# EAGLE design MKL02_Programmer (EAGLE 9.5.2)
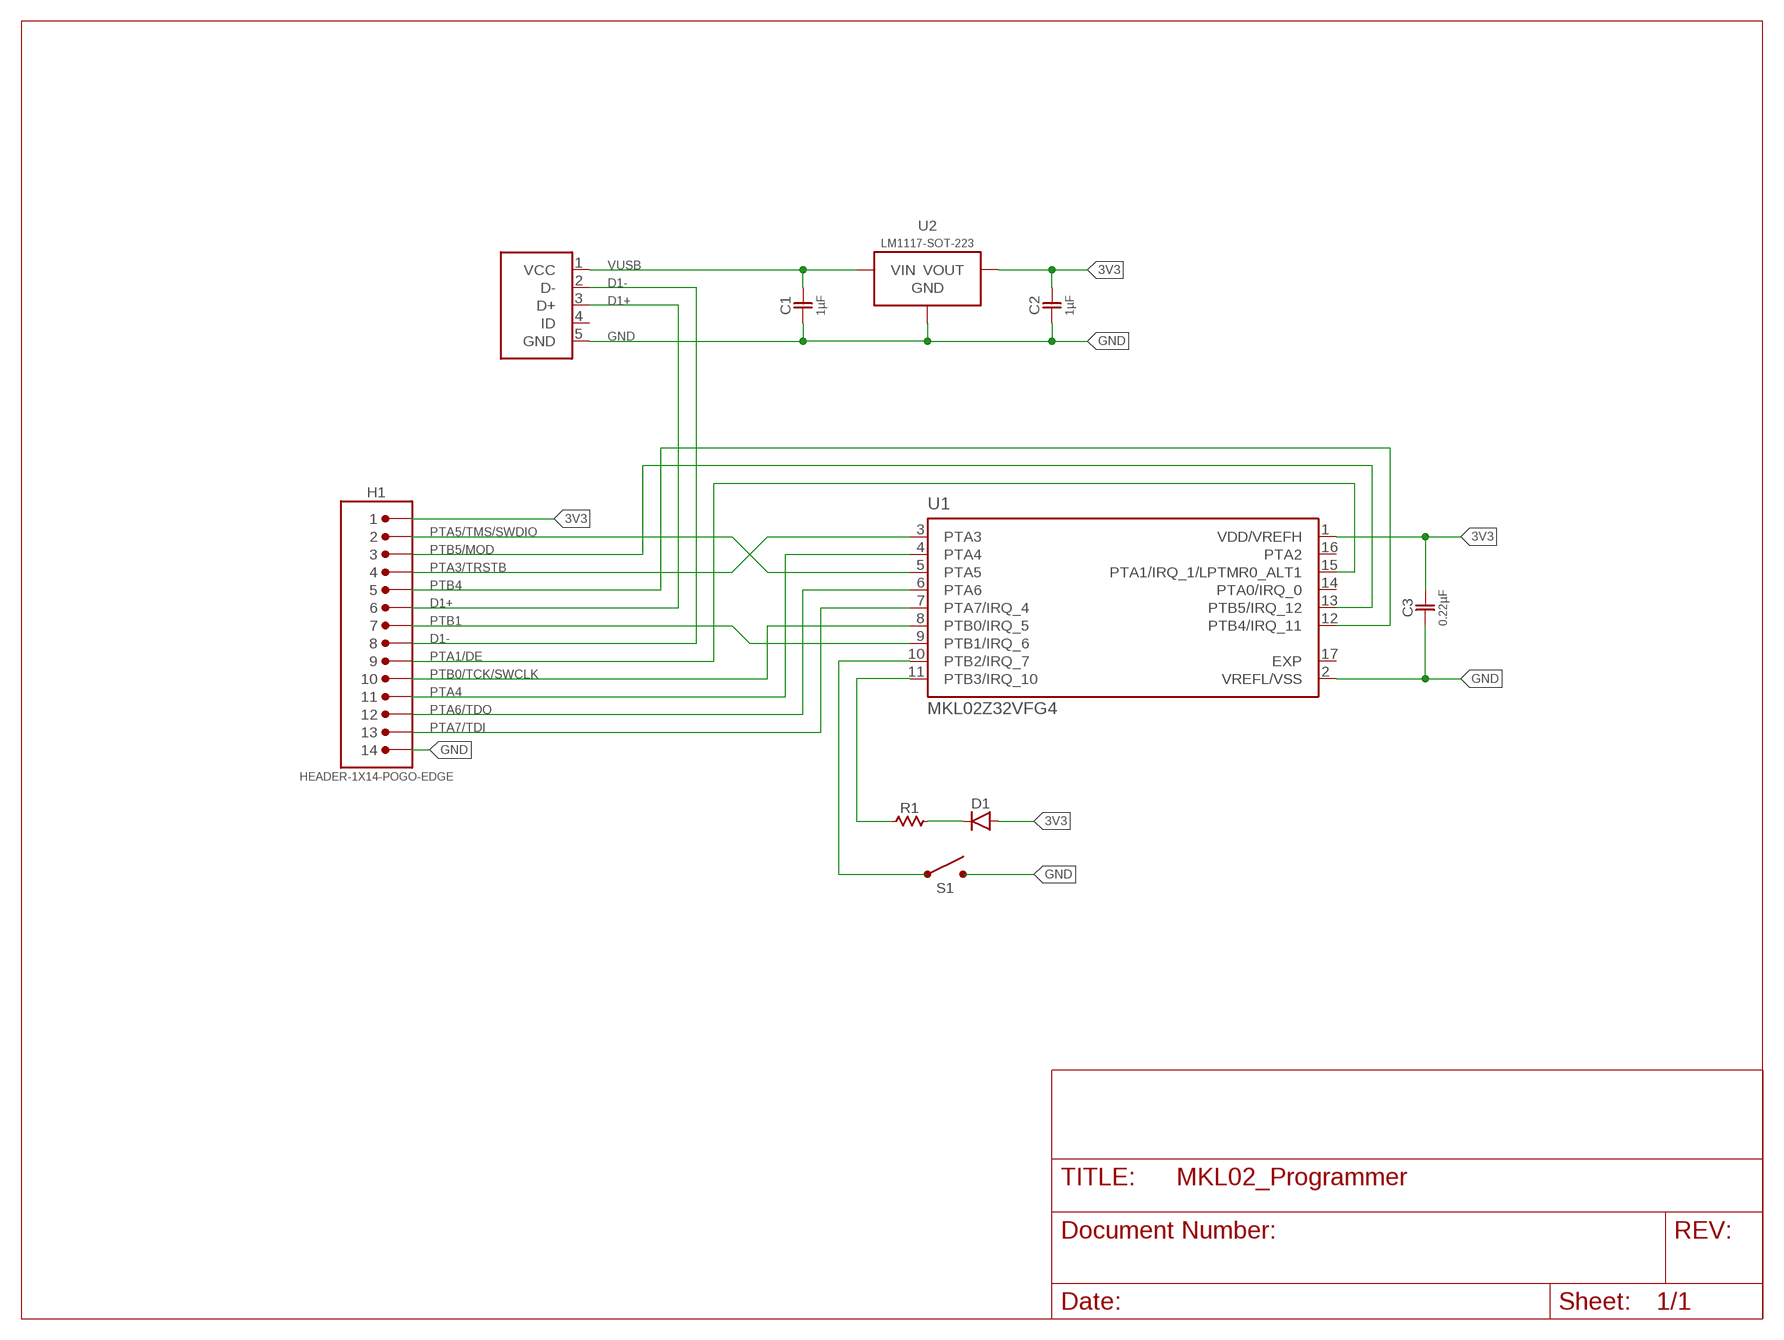
[diagram p0: schematic, sheet 1]

## Parts
C1  1µF  CAP-NP-0805  [0805-NP]
C2  1µF  CAP-NP-0805  [0805-NP]
C3  0.22µF  CAP-NP-0805  [0805-NP]
D1  DIODE-0805  [0805-P]
H1  HEADER-1X14-POGO-EDGE  [2X7-1.27MM-POGO-EDGE]
J1  USB-5-MICRO-B  [USB-MICRO-B]
R1  RESISTOR-0805  [0805-NP]
S1  SPST-6X6  [BUTTON-EVQQ2]
U1  MKL02Z32VFG4  [QFN50P300X300X65-17N]
U2  LM1117-SOT-223  [SOT-223]

## Nets
3V3: C2.2 C3.2 D1.A H1.1 U1.1(VDD/VREFH) U2.2(VOUT) U2.4(VOUT)
D1+: H1.6 J1.3(D+)
D1-: H1.8 J1.2(D-)
GND: C1.1 C2.1 C3.1 H1.14 J1.5(GND) S1.B1 S1.B2 U1.2(VREFL/VSS) U2.1(GND)
N$1: S1.A1 S1.A2 U1.10(PTB2/IRQ_7)
N$2: R1.1 U1.11(PTB3/IRQ_10)
N$3: D1.K(C) R1.2
PTA1/DE: H1.9 U1.15(PTA1/IRQ_1/LPTMR0_ALT1)
PTA3/TRSTB: H1.4 U1.3(PTA3)
PTA4: H1.11 U1.4(PTA4)
PTA5/TMS/SWDIO: H1.2 U1.5(PTA5)
PTA6/TDO: H1.12 U1.6(PTA6)
PTA7/TDI: H1.13 U1.7(PTA7/IRQ_4)
PTB0/TCK/SWCLK: H1.10 U1.8(PTB0/IRQ_5)
PTB1: H1.7 U1.9(PTB1/IRQ_6)
PTB4: H1.5 U1.12(PTB4/IRQ_11)
PTB5/MOD: H1.3 U1.13(PTB5/IRQ_12)
VUSB: C1.2 J1.1(VCC) U2.3(VIN)
Unconnected: J1.4(ID) U1.14(PTA0/IRQ_0) U1.16(PTA2)

## Power pins joined to a net without a drawn wire
EXP: U1.17(EXP)

## Library data of the parts
C1-C3 = T2M_4_0:CAP-NP
D1 = T2M_4_0:DIODE
H1 = T2M_4_0:HEADER-1X14
J1 = T2M_4_0:USB-5
R1 = T2M_4_0:RESISTOR
S1 = T2M_4_0:SPST
U1 = T2M_4_0:MKL02Z32VFG4: MCU 32-Bit KL02 ARM Cortex M0+ RISC 32KB Flash 1.8V/2.5V/3.3V 16-Pin QFN EP Tray; DESCRIPTION: 32 Bit Microcontroller, Kinetis L Series Ultra Low Power, ARM Cortex-M0+, 48 MHz, 32 KB, 4 KB, 16; DIGI-KEY_PART_NUMBER: MKL02Z32VFG4-ND; DIGI-KEY_PURCHASE_URL: https://www.digikey.com/product-detail/en/nxp-usa-inc/MKL02Z32VFG4/MKL02Z32VFG4-ND/4234778?utm_source=snapeda&utm_medium=aggregator&utm_campaign=symbol; MF: NXP USA; MP: MKL02Z32VFG4; PACKAGE: QFN-16 NXP Semiconductors
U2 = T2M_4_0:LM1117: 800mA and 1A Low Dropout (LDO) Positive Regulator 1.8V, 2.5V, 2.85V, 3.3V, 5V, and Adj

## Board
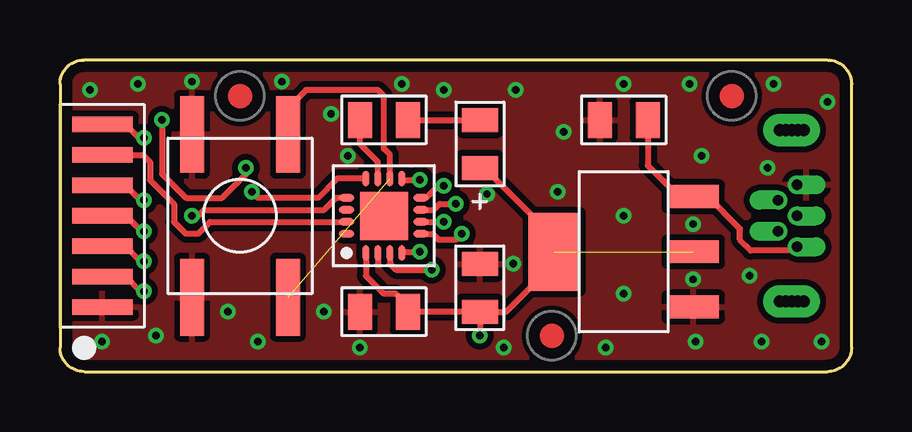
[diagram p1: board, top side]
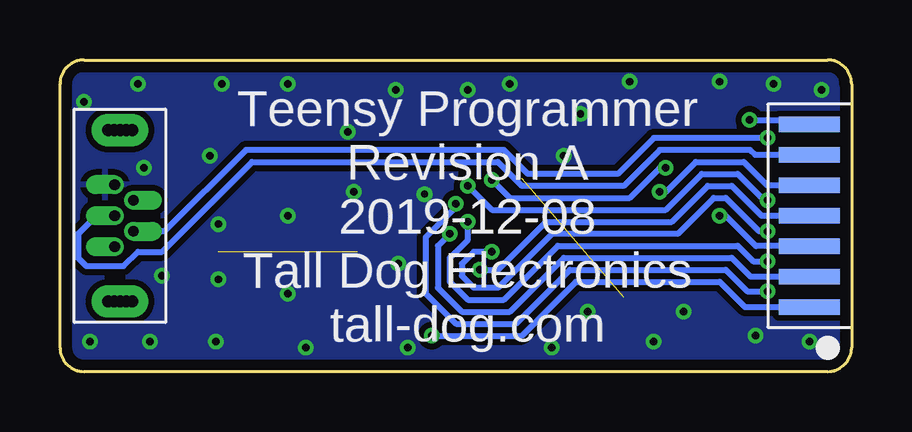
[diagram p2: board, bottom side, seen from below]

Size 33 x 13 mm. Coordinates in mm from the lower left corner, seen from the top.
Outline: 1,0 32,0 arc90 33,1 33,12 arc90 32,13 1,13 arc90 0,12 0,1 arc90 1,0
Copper layers (1*16): Top 0.035mm / dielectric 1.5mm / Bottom 0.035mm
Design rules "default *": minimum track width 6mil, minimum drill 0.3mm, track to track 6mil, track to pad 6mil, pad to pad 6mil, via to via 6mil, smd to smd 6mil, copper to edge 17mil, drill to drill 6mil, minimum pad ring 7mil, minimum via ring 7mil, stop-mask expansion 0mil, vias tented up to drill 0.3mm, thermal gap 0.25mm

### Footprints (pad centres in the part's own frame; a part is rotated, then mirrored left to right if it is on the bottom)
0805-NP = smd 1 x 1.5: 1 -1,0; 2 1,0
0805-P = smd 1 x 1.5: A -1,0; K 1,0
2X7-1.27MM-POGO-EDGE = smd 0.635 x 2.54 bottom: 1 -3.81,-1.77; 2 -2.54,-1.77; 3 -1.27,-1.77; 4 0,-1.77; 5 1.27,-1.77; 6 2.54,-1.77; 7 3.81,-1.77 | smd 0.635 x 2.54: 8 3.81,-1.77; 9 2.54,-1.77; 10 1.27,-1.77; 11 0,-1.77; 12 -1.27,-1.77; 13 -2.54,-1.77; 14 -3.81,-1.77
USB-MICRO-B = drill 0.44 pad 0.74 offset: 1 -1.3,0.22; 2 -0.65,-0.56; 3 0,0.22; 4 0.65,-0.56; 5 1.3,0.22 | drill 0.5 pad 1.35: G1A -3.575,0.5; G1B -3.575,0.25; G1C -3.575,0; G1D -3.575,-0.25; G1E -3.575,-0.5; G2A 3.575,0.5; G2B 3.575,0.25; G2C 3.575,0; G2D 3.575,-0.25; G2E 3.575,-0.5
BUTTON-EVQQ2 = smd 3.2 x 1: A1 -3.4,-2; A2 3.4,-2; B1 -3.4,2; B2 3.4,2
QFN50P300X300X65-17N = smd 0.65 x 0.3: 1 -1.55,0.75; 2 -1.55,0.25; 3 -1.55,-0.25; 4 -1.55,-0.75; 9 1.55,-0.75; 10 1.55,-0.25; 11 1.55,0.25; 12 1.55,0.75 | smd 0.3 x 0.65: 5 -0.75,-1.55; 6 -0.25,-1.55; 7 0.25,-1.55; 8 0.75,-1.55; 13 0.75,1.55; 14 0.25,1.55; 15 -0.25,1.55; 16 -0.75,1.55 | smd 2 x 2: 17 0,0
SOT-223 = smd 0.95 x 2.15: 1 -2.3,-2.9; 2 0,-2.9; 3 2.3,-2.9 | smd 3.25 x 2.15: 4 0,2.9

### Placement (x,y rotation side)
C1  23.5,10.5 0 top
C2  17.5,3.5 270 top
C3  13.5,2.5 0 top
D1  17.5,9.5 90 top
H1  0,6.5 90 top
J1  30.5,6.5 90 bottom
R1  13.5,10.5 0 top
S1  7.5,6.5 90 top
U1  13.5,6.5 90 top
U2  23.5,5 90 top
U$1  [FIDUCIAL]  28,11.5 0 top
U$2  [FIDUCIAL]  20.5,1.5 0 top
U$3  [FIDUCIAL]  7.5,11.5 0 top

### Tracks (layer width: path | path; a pad name or v marks a point on that pad's centre or on a via)
3V3  (via drill 0.3)  (1 unrouted)
  Top 0.25: C2.2 18.6,2.5 20.6,4.5 U2.4 20.6,5.6 17.7,8.5 D1.A | C2.2 v17.5,1.5 | U1.1 12.75,4 13.5,3.25 14,3.25 14.5,2.75 C3.2 C2.2
  Bottom 0.25: v17.5,1.5 13.75,1.5 11.5,3.75 5.5,3.75 4.44,2.69 H1.1
D1+
  Bottom 0.25: J1.3 31.5,6.5 32.25,5.75 32.25,4.75 31.9,4.4 30.35,4.4 29.75,5 28.75,5 25,8.75 14.75,8.75 13.75,7.75 9.5,7.75 8,9.25 4.23,9.25 4.02,9.04 H1.6
D1-  (via drill 0.3)
  Top 0.25: H1.8 2.74,10.31 3.3,9.75 v3.5,9.75
  Bottom 0.25: J1.2 28.65,5.85 25.25,9.25 14.5,9.25 13.5,8.25 9.75,8.25 8.25,9.75 v3.5,9.75
GND  (via drill 0.3)
  Top 0.25: U1.2 13.25,4.5
  other vias: 17.8,7.4 11,2.5 7,2.5 4,1.5 1.75,1.25 1.25,11.75 3.25,12 9.25,12.1 11.3,10.75 14.25,12 16,11.75 21,10 19,11.75 20.75,7.5 8.25,1.25 12.5,1 18.9,4.5 18.5,1 29.5,8.5 32,11.25 31.75,1.25 26.5,1.25 29.25,1.25 22.75,1 23.5,3.25 23.5,6.5 23.5,12 26.75,9 26.25,12 12,9 26.4,6.15 26.4,3.85 28.75,4 29.75,12 5.5,12.1
  pour Top (isolate 0.25): 0,13 33,13 33,0 0,0
  pour Bottom (isolate 0.25): 0,13 33,13 33,0 0,0
N$1  (1 unrouted)
  Top 0.25: U1.10 13.75,9.05 13.5,9.3 13.5,11.5 13.25,11.75 10.26,11.75 9.5,10.99 S1.A2
N$2
  Top 0.25: U1.11 13.25,8.75 12.5,9.5 R1.1
N$3
  Top 0.25: R1.2 D1.K
PTA1/DE
  Top 0.25: U1.15 6.25,6.25 5.75,5.75 5.25,5.75 4.75,6.25 4.75,7 3.75,8 3.75,8.75 3.46,9.04 H1.9
PTA3/TRSTB  (via drill 0.3)
  Top 0.25: U1.3 13.75,4.5 14,4.25 v15.5,4.25
  Bottom 0.25: H1.4 3.75,6.5 5,7.75 6,7.75 7.5,6.25 12.75,6.25 14.75,4.25 v15.5,4.25
PTA4  (via drill 0.3)
  Top 0.25: U1.4 14.3,5 v15,5 | H1.11 2.75,6.5 3.4,5.85 v3.5,5.85
  Bottom 0.25: v3.5,5.85 3.85,5.85 5.25,7.25 5.75,7.25 7.25,5.75 12.5,5.75 14.75,3.5 15.75,3.5 16.25,4 16.25,4.5 15.75,5 v15,5
PTA5/TMS/SWDIO  (via drill 0.3)
  Top 0.25: U1.5 15.55,5.75 15.8,5.5 16.5,5.5 v16.75,5.75
  Bottom 0.25: v16.75,5.75 17.25,5.25 17.25,3.5 16.25,2.5 14.25,2.5 12,4.75 5,4.75 4.21,3.96 H1.2
PTA6/TDO  (via drill 0.3)
  Top 0.25: U1.6 v16,6.25 | H1.12 2.72,5.23 3.35,4.6 v3.5,4.6
  Bottom 0.25: v3.5,4.6 4.1,4.6 4.75,5.25 12.25,5.25 14.5,3 16,3 16.75,3.75 16.75,4.75 16,5.5 v16,6.25
PTA7/TDI  (via drill 0.3)
  Top 0.25: U1.7 15.58,6.75 15.83,7 v16.5,7 | H1.13 2.74,3.96 3.35,3.35 v3.5,3.35
  Bottom 0.25: v16.5,7 16.5,6.86 17.75,5.61 17.75,3.25 16.5,2 14,2 11.75,4.25 5.25,4.25 4.35,3.35 v3.5,3.35
PTB0/TCK/SWCLK  (via drill 0.3)
  Top 0.25: U1.8 15.25,7.25 15.75,7.75 v16,7.75 | H1.10 2.73,7.77 3.35,7.15 v3.5,7.15
  Bottom 0.25: v3.5,7.15 3.65,7.15 4.75,8.25 6.25,8.25 7.75,6.75 15,6.75 v16,7.75
PTB1  (via drill 0.3)
  Top 0.25: U1.9 14.3,8 v15,8 | v4.25,10.5 4.25,8.25 5.25,7.25 6.75,7.25 7.75,8.25 v7.75,8.5
  Bottom 0.25: v4.25,10.5 3,10.5 2.81,10.31 H1.7 | v7.75,8.5 8,8.5 9.25,7.25 14.25,7.25 v15,8
PTB4  (via drill 0.3)
  Top 0.25: U1.12 11.55,8.05 10.75,7.25 8.25,7.25 v8,7.5
  Bottom 0.25: H1.5 3.52,7.77 4.5,8.75 6.5,8.75 7.75,7.5 v8,7.5
PTB5/MOD  (via drill 0.3)
  Top 0.25: U1.13 11.5,7.25 11,6.75 6,6.75 5.75,6.5 v5.5,6.5
  Bottom 0.25: H1.3 3.98,5.23 5.25,6.5 v5.5,6.5
VUSB
  Top 0.25: C1.2 24.5,8.6 25.8,7.3 U2.3 27,7.3 28.35,5.95 28.35,5.5 28.8,5.05 30.57,5.05 J1.1

### Text on the board
bPlace: Teensy Programmer / Revision A / 2019-12-08 / Tall Dog Electronics / tall-dog.com